# EAGLE design 4relais_4.2 (EAGLE 5.00)
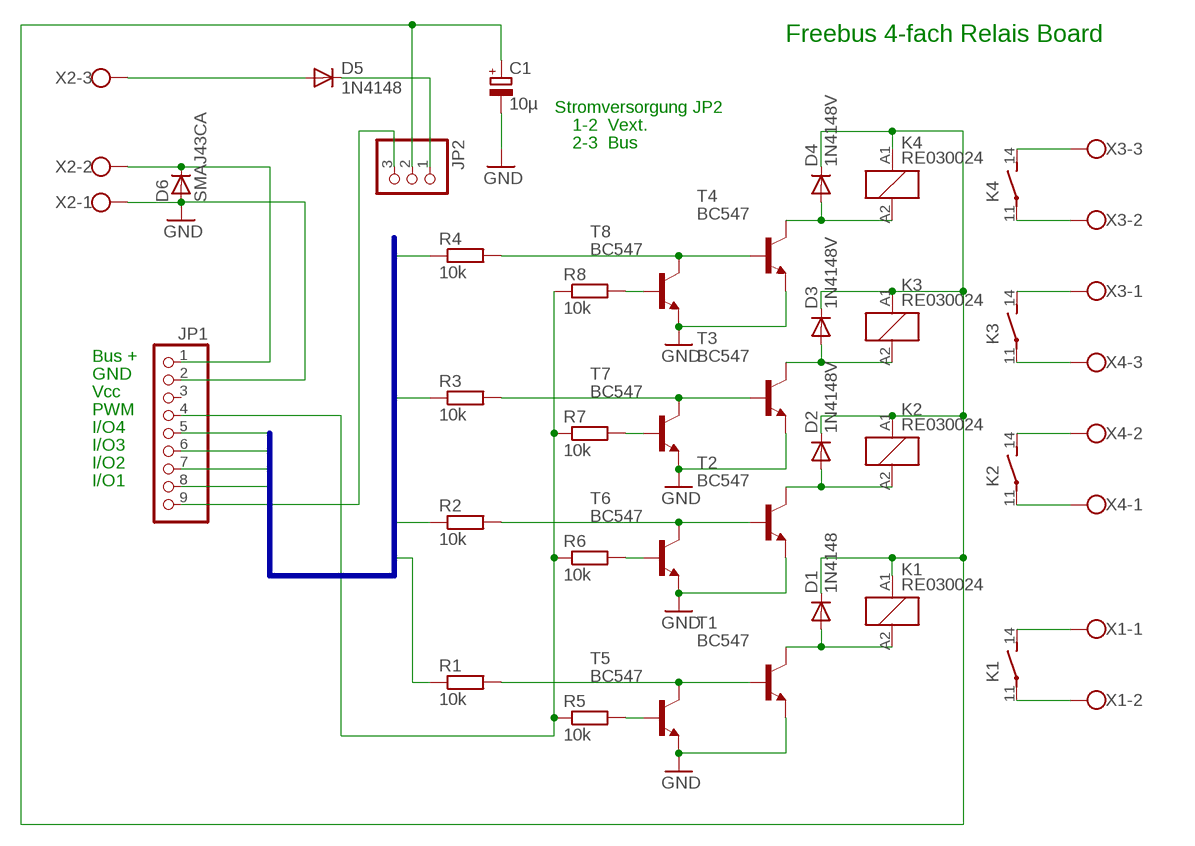
[diagram p0: schematic, sheet 1]

## Parts
C1  10µ  CPOL-EUE3.5-10  [E3,5-10]
D1  1N4148  [DO35-10]
D2  1N4148V  1N41481448V  [D-2.5]
D3  1N4148V  1N41481448V  [D-2.5]
D4  1N4148V  1N41481448V  [D-2.5]
D5  1N4148  [DO35-10]
D6  SMAJ43CA  D-SMB  [SMB]
JP1  PINHD-1X9  [1X09]
JP2  PINHD-1X3  [1X03]
K1  RE030024  [RE-SCHRACK]
K2  RE030024  [RE-SCHRACK]
K3  RE030024  [RE-SCHRACK]
K4  RE030024  [RE-SCHRACK]
R1  10k  R-EU_0207/12  [0207/12]
R2  10k  R-EU_0207/2V  [0207/2V]
R3  10k  R-EU_0207/2V  [0207/2V]
R4  10k  R-EU_0207/2V  [0207/2V]
R5  10k  R-EU_0207/7  [0207/7]
R6  10k  R-EU_0207/7  [0207/7]
R7  10k  R-EU_0207/7  [0207/7]
R8  10k  R-EU_0207/2V  [0207/2V]
T1  BC547  [TO92]
T2  BC547  [TO92]
T3  BC547  [TO92]
T4  BC547  [TO92]
T5  BC547  [TO92]
T6  BC547  [TO92]
T7  BC547  [TO92]
T8  BC547  [TO92]
X1  W237-02P  [W237-132]
X2  W237-3E  [W237-3E]
X3  W237-3E  [W237-3E]
X4  W237-3E  [W237-3E]

## Nets
GND: C1.- D6.2(A) JP1.2 T1.1(E) T2.1(E) T3.1(E) T4.1(E) T5.1(E) T6.1(E) T7.1(E) T8.1(E) X2.1
IO1: JP1.8 R1.1
IO2: JP1.7 R2.1
IO3: JP1.6 R3.1
IO4: JP1.5 R4.1
N$1: D5.A X2.3
N$2: K3.14(2:S) X3.1
N$3: JP1.9 JP2.3
N$4: D6.1(C) JP1.1 X2.2
N$5: K4.11(2:P) X3.2
N$6: K4.14(2:S) X3.3
N$7: K3.11(2:P) X4.3
N$8: K2.14(2:S) X4.2
N$9: K2.11(2:P) X4.1
N$10: K1.14(2:S) X1.1
N$11: R4.2 T4.2(B) T8.3(C)
N$12: JP1.4 R5.1 R6.1 R7.1 R8.1
N$13: K1.11(2:P) X1.2
N$14: R3.2 T3.2(B) T7.3(C)
N$17: R2.2 T2.2(B) T6.3(C)
N$18: R1.2 T1.2(B) T5.3(C)
N$19: D2.A K2.A2 T2.3(C)
N$20: R8.2 T8.2(B)
N$21: R7.2 T7.2(B)
N$22: R6.2 T6.2(B)
N$23: R5.2 T5.2(B)
N$24: D1.A K1.A2 T1.3(C)
N$31: D5.C JP2.1
R3: D3.A K3.A2 T3.3(C)
R4: D4.A K4.A2 T4.3(C)
VDD_IN: C1.+ D1.C D2.C D3.C D4.C JP2.2 K1.A1 K2.A1 K3.A1 K4.A1
Unconnected: JP1.3

## Buses
IO[1..4]

## Notes on the sheet
- Freebus 4-fach Relais Board
- Stromversorgung JP2
- 1-2  Vext.
- 2-3  Bus
- Bus +
- GND
- Vcc
- PWM
- I/O4
- I/O3
- I/O2
- I/O1

## Library data of the parts
C1 = rcl:CPOL-EU: POLARIZED CAPACITOR, European symbol
D1-D5 = diode:1N4148: DIODE high speed (Philips)
D6 = semicon-smd-ipc:D-: DIODE unfilled
JP1 = pinhead:PINHD-1X9: PIN HEADER
JP2 = pinhead:PINHD-1X3: PIN HEADER
K1-K4 = relay:RE03*: Miniature PCB Relay 1 pole 6 A SCHRACK Source: http://www.schrack.com/.. 5812.pdf
R1-R8 = rcl:R-EU_: RESISTOR, European symbol
T1-T8 = transistor-npn:BC547*: NPN Transistor
X1 = con-wago-508:W237-02P: WAGO SREW CLAMP
X2-X4 = con-wago-508:W237-3E: WAGO SREW CLAMP

## Board
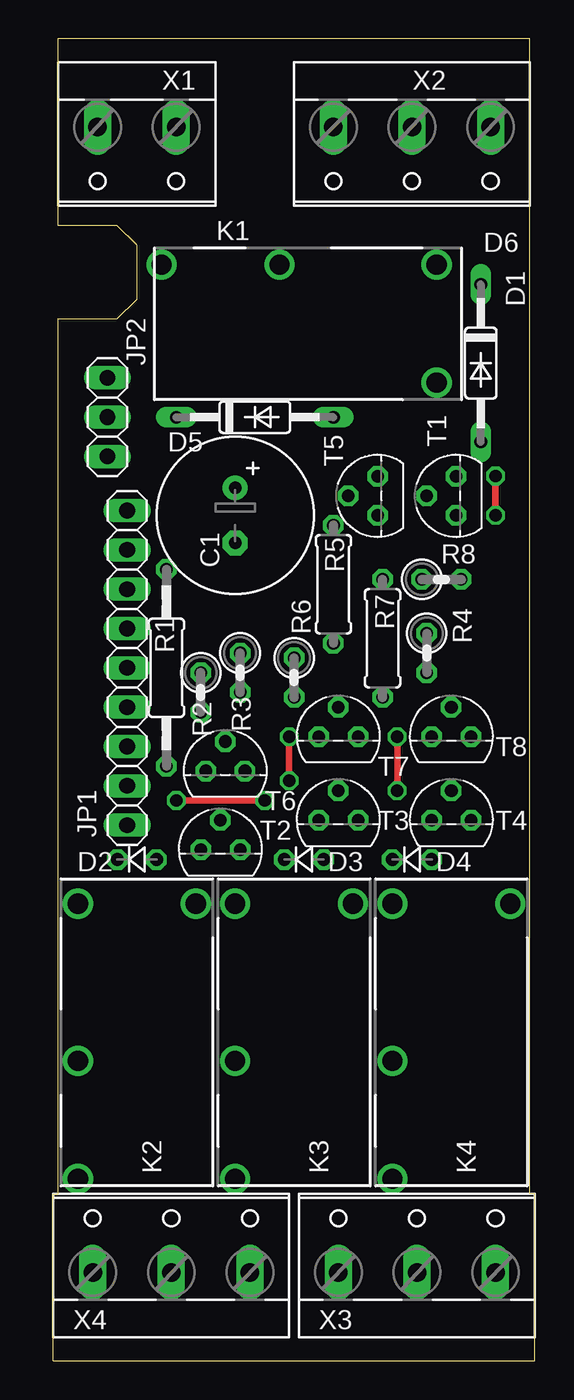
[diagram p1: board, top side]
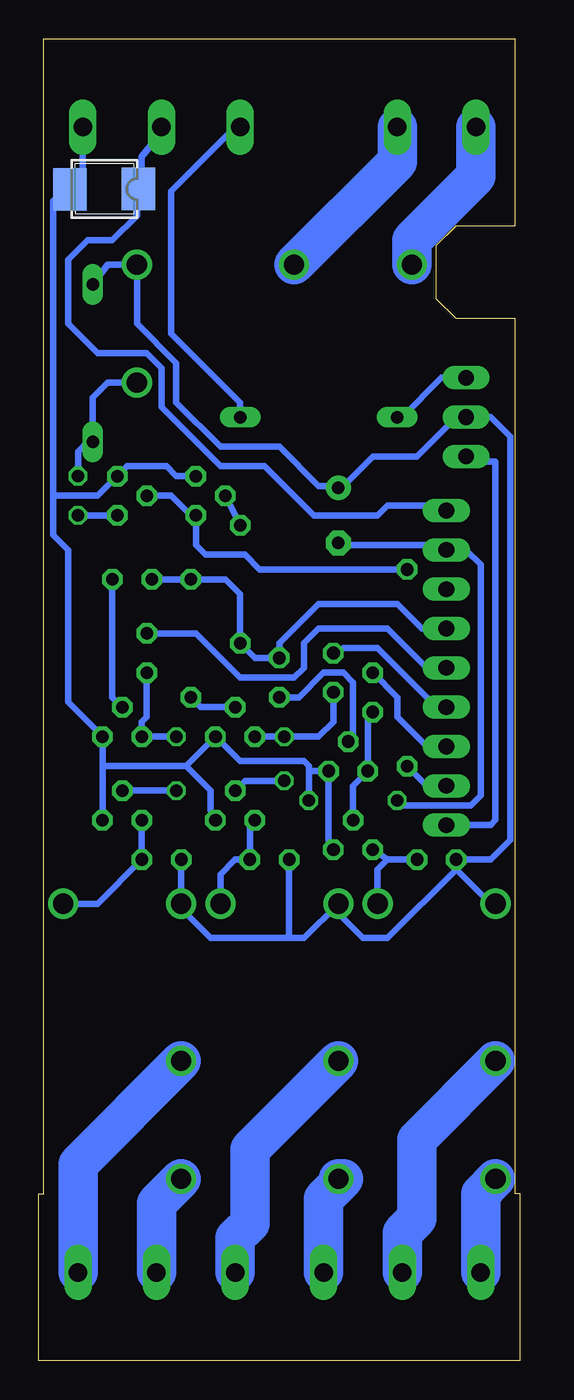
[diagram p2: board, bottom side, seen from below]

Size 31.11 x 85.41 mm. Coordinates in mm from the lower left corner, seen from the top.
Outline: 0,0 0,10.79 0.32,10.79 0.32,67.31 4.13,67.31 5.4,68.58 5.4,72.07 4.13,73.34 0.32,73.34 0.32,85.41 30.8,85.41 30.8,10.79 31.11,10.79 31.11,0 0,0
Copper layers (1*16): Top 0.035mm / dielectric 1.5mm / Bottom 0.035mm
Design rules "default *": minimum track width 10mil, minimum drill 24mil, track to track 12mil, track to pad 12mil, pad to pad 12mil, via to via 12mil, smd to smd 8mil, copper to edge 12mil, drill to drill 8mil, minimum pad ring 10mil, minimum via ring 8mil, stop-mask expansion 4mil, vias tented up to drill 0mil, thermal gap 10mil

### Footprints (pad centres in the part's own frame; a part is rotated, then mirrored left to right if it is on the bottom)
E3,5-10 = drill 0.813 pad 1.6 round: + -1.778,0 | drill 0.813 pad 1.6 octagon: - 1.778,0
DO35-10 = drill 0.813 long: A 5.08,0; C -5.08,0
D-2.5 = drill 0.813 octagon: A 1.27,0; C -1.27,0
SMB = smd 2.159 x 2.743: 1 -2.311,-0.127; 2 2.108,-0.102
1X09 = drill 1.016 long: 1 -10.16,0; 2 -7.62,0; 3 -5.08,0; 4 -2.54,0; 5 0,0; 6 2.54,0; 7 5.08,0; 8 7.62,0; 9 10.16,0
1X03 = drill 1.016 long: 1 -2.54,0; 2 0,0; 3 2.54,0
RE-SCHRACK = drill 1.3 round: 11 8.89,-3.81; 14 1.27,-3.81; A1 -8.89,-3.81; A2 -8.89,3.81
0207/12 = drill 0.813 octagon: 1 -6.35,0; 2 6.35,0
0207/2V = drill 0.813 octagon: 1 -1.27,0; 2 1.27,0
0207/7 = drill 0.813 octagon: 1 -3.81,0; 2 3.81,0
TO92 = drill 0.813 octagon: 1 1.27,0; 2 0,1.905; 3 -1.27,0
W237-132 = drill 1.194 long: 1 -2.54,-0.635; 2 2.54,-0.635
W237-3E = drill 1.194 long: 1 -5.08,-0.635; 2 0,-0.635; 3 5.08,-0.635

### Placement (x,y rotation side)
C1  11.75,54.61 270 top
D1  27.62,64.45 270 top
D2  5.4,32.38 0 top
D3  16.19,32.38 0 top
D4  23.18,32.38 0 top
D5  13.02,60.96 0 top
D6  26.99,75.56 180 bottom
JP1  4.76,44.77 270 top
JP2  3.49,60.96 270 top
K1  15.88,66.99 180 top
K2  5.4,20.64 270 top
K3  15.56,20.64 270 top
K4  25.72,20.64 270 top
R1  7.3,44.77 90 top
R2  9.53,43.18 270 top
R3  12.07,44.45 270 top
R4  24.13,45.72 270 top
R5  18.1,50.16 90 top
R6  10k  [0207/2V]  15.56,44.13 270 top
R7  21.27,46.67 270 top
R8  25.08,50.48 0 top
T1  26.04,55.88 90 top
T2  10.79,33.02 0 top
T3  18.41,34.92 0 top
T4  25.72,34.92 0 top
T5  20.95,55.88 90 top
T6  11.11,38.1 0 top
T7  18.41,40.32 0 top
T8  25.72,40.32 0 top
X1  5.4,79.06 180 top
X2  23.18,79.06 180 top
X3  23.49,6.35 0 top
X4  7.62,6.35 0 top

### Tracks (layer width: path | path; a pad name or v marks a point on that pad's centre or on a via)
GND  (via drill 0.8)
  Top 0.406: v7.94,36.2 v13.65,36.2
  Bottom 0.406: 21.59,38.42 T7.1 18.1,38.73 13.97,38.73 13.65,38.42 13.65,38.1 | 26.99,38.42 T4.1 | 26.99,38.42 T8.1 29.21,42.55 29.21,52.39 30.16,53.34 30.16,55.88 | T2.1 12.38,33.66 T6.1 13.65,38.1 | T5.1 22.22,57.15 22.86,57.78 25.4,57.78 T1.1 27.31,55.88 30.16,55.88 | 29.1,75.36 30.16,74.93 30.16,55.88 | X2.1 28.26,75.88 28.89,75.56 29.1,75.36 | 29.1,75.36 D6.2 | C1.- 11.43,52.7 5.71,52.7 5.4,52.39 JP1.2 3.49,52.39 2.54,51.44 2.54,36.51 3.17,35.88 7.62,35.88 v7.94,36.2 | 21.59,38.42 26.99,38.42 | v13.65,36.2 13.65,38.1 | T3.1 19.68,35.24 20,35.56 20,36.83 21.59,38.42
IO1
  Bottom 0.406: JP1.8 6.03,37.15 6.35,37.47 R1.1
IO2
  Bottom 0.406: JP1.7 6.03,39.69 7.94,41.59 7.94,42.86 R2.1
IO3
  Bottom 0.406: JP1.6 5.4,42.23 9.21,46.04 11.43,46.04 11.75,45.72 R3.1
IO4
  Bottom 0.406: JP1.5 6.03,44.77 8.57,47.31 13.02,47.31 13.97,46.35 13.97,44.77 14.6,44.13 18.1,44.13 20.95,46.99 R4.1
N$1
  Bottom 0.406: X2.3 18.42,79.69 22.54,75.56 22.54,66.36 18.1,61.91 D5.A
N$2
  Bottom 2.54: X3.1 18.42,7.94 17.46,8.89 17.46,13.65 K3.14
N$3
  Bottom 0.406: JP1.9 1.9,34.61 1.59,34.92 1.59,58.1 3.49,58.1 JP2.3
N$4
  Bottom 0.406: X2.2 23.18,79.38 24.45,77.79 24.45,75.56 24.68,75.48 D6.1 24.68,75.79 24.77,75.88 24.77,73.98 26.35,72.39 27.94,72.39 29.21,71.12 29.21,66.99 27.31,65.09 24.13,65.09 23.18,64.14 23.18,61.59 19.37,57.78 16.51,57.78 13.34,54.61 9.21,54.61 8.57,55.24 5.4,55.24 5.08,54.93 JP1.1
N$5
  Bottom 2.54: X3.2 23.49,10.16 K4.11
N$6
  Bottom 2.54: X3.3 28.58,12.7 K4.14
N$7
  Bottom 2.54: K3.11 11.43,11.75 12.7,10.48 X4.3
N$8
  Bottom 2.54: X4.2 7.62,8.26 6.67,9.21 6.67,14.29 K2.14
N$9
  Bottom 2.54: X4.1 2.54,10.79 K2.11
N$10
  Bottom 2.54: K1.14 7.94,77.47 X1.1
N$11  (via drill 0.8)
  Top 0.406: v22.22,40.32 v22.22,36.83
  Bottom 0.406: R4.2 24.13,41.59 24.45,41.27 T8.3 v22.22,40.32 | v22.22,36.83 T4.2
N$12
  Bottom 0.406: JP1.4 6.35,47.31 7.94,48.9 13.02,48.9 15.56,46.35 R6.1 17.15,45.4 R5.1 18.1,49.53 19.05,50.48 R7.1 R8.1 23.81,50.8
N$13
  Bottom 2.54: X1.2 2.86,76.52 6.99,72.39 K1.11
N$14  (via drill 0.8)
  Top 0.406: v15.24,40.32 v15.24,37.47
  Bottom 0.406: R3.2 12.07,41.27 13.02,40.32 v15.24,40.32 T7.3 | v15.24,37.47 17.78,37.47 T3.2
N$17
  Bottom 0.406: T2.2 10.79,37.15 T6.3 9.84,41.59 R2.2
N$18
  Bottom 0.406: T1.2 22.54,55.88 21.27,54.61 T5.3 20.95,52.7 20.32,52.07 17.78,52.07 16.83,51.12 R1.2
N$19
  Bottom 0.406: D2.A 8.57,32.38 | 8.57,32.38 T2.3 | K2.A2 9.21,31.75 8.57,32.38
N$20
  Bottom 0.406: T8.2 26.35,42.86 R8.2
N$21
  Bottom 0.406: T7.2 20.64,42.23 R7.2
N$22
  Bottom 0.406: R6.2 14.29,42.86 12.7,44.45 11.43,44.45 10.79,43.81 10.79,40.32 T6.2
N$23
  Bottom 0.406: R5.2 T5.2
N$24  (via drill 0.8)
  Top 0.406: v28.58,57.15 v28.58,54.61
  Bottom 0.406: K1.A2 26.67,63.18 27.62,62.23 D1.A 27.94,59.37 28.58,58.74 v28.58,57.15 | T1.3 v28.58,54.61
N$31
  Bottom 0.406: D5.C 7.62,60.96 5.08,63.5 JP2.1
R3
  Bottom 0.406: K3.A2 19.37,31.43 18.42,32.38 D3.A 17.46,34.92 T3.3
R4
  Bottom 0.406: K4.A2 27.31,29.53 D4.A T4.3
VDD_IN
  Bottom 0.406: K2.A1 1.9,29.53 4.13,31.75 | 4.13,31.75 D2.C 1.9,32.38 0.64,33.66 0.64,59.69 1.9,60.96 JP2.2 4.13,60.96 6.67,58.42 9.52,58.42 11.43,56.52 | 4.13,31.75 8.57,27.3 10.16,27.3 11.75,28.89 K3.A1 13.97,27.3 14.92,27.3 | 14.92,27.3 20,27.3 21.91,29.21 K4.A1 D4.C | 14.92,27.3 D3.C | D1.C 26.67,70.8 K1.A1 24.77,66.99 22.22,64.45 22.22,61.91 19.37,59.05 15.56,59.05 13.02,56.52 11.43,56.52 | 11.43,56.52 C1.+